# Altium schematic sheet [3] TopLevel.SchDoc: =DocumentName
size A3; ENG_APP_DATE: --/--/--; DSN_APP_DATE: --/--/--; CHK_APP_DATE: --/--/--; Organization: ORGANIZATION; Address1: R. Aprígio Veloso, 882, Universitário; Address2: Campina Grande - PB; Address3: 58429-900; DocumentNumber: 3; Revision: -; SheetNumber: 3; SheetTotal: 9; ENG_DATE: --/--/--; DSN_DATE: --/--/--; CHK_DATE: --/--/--; SCH_SCALE: 1:1
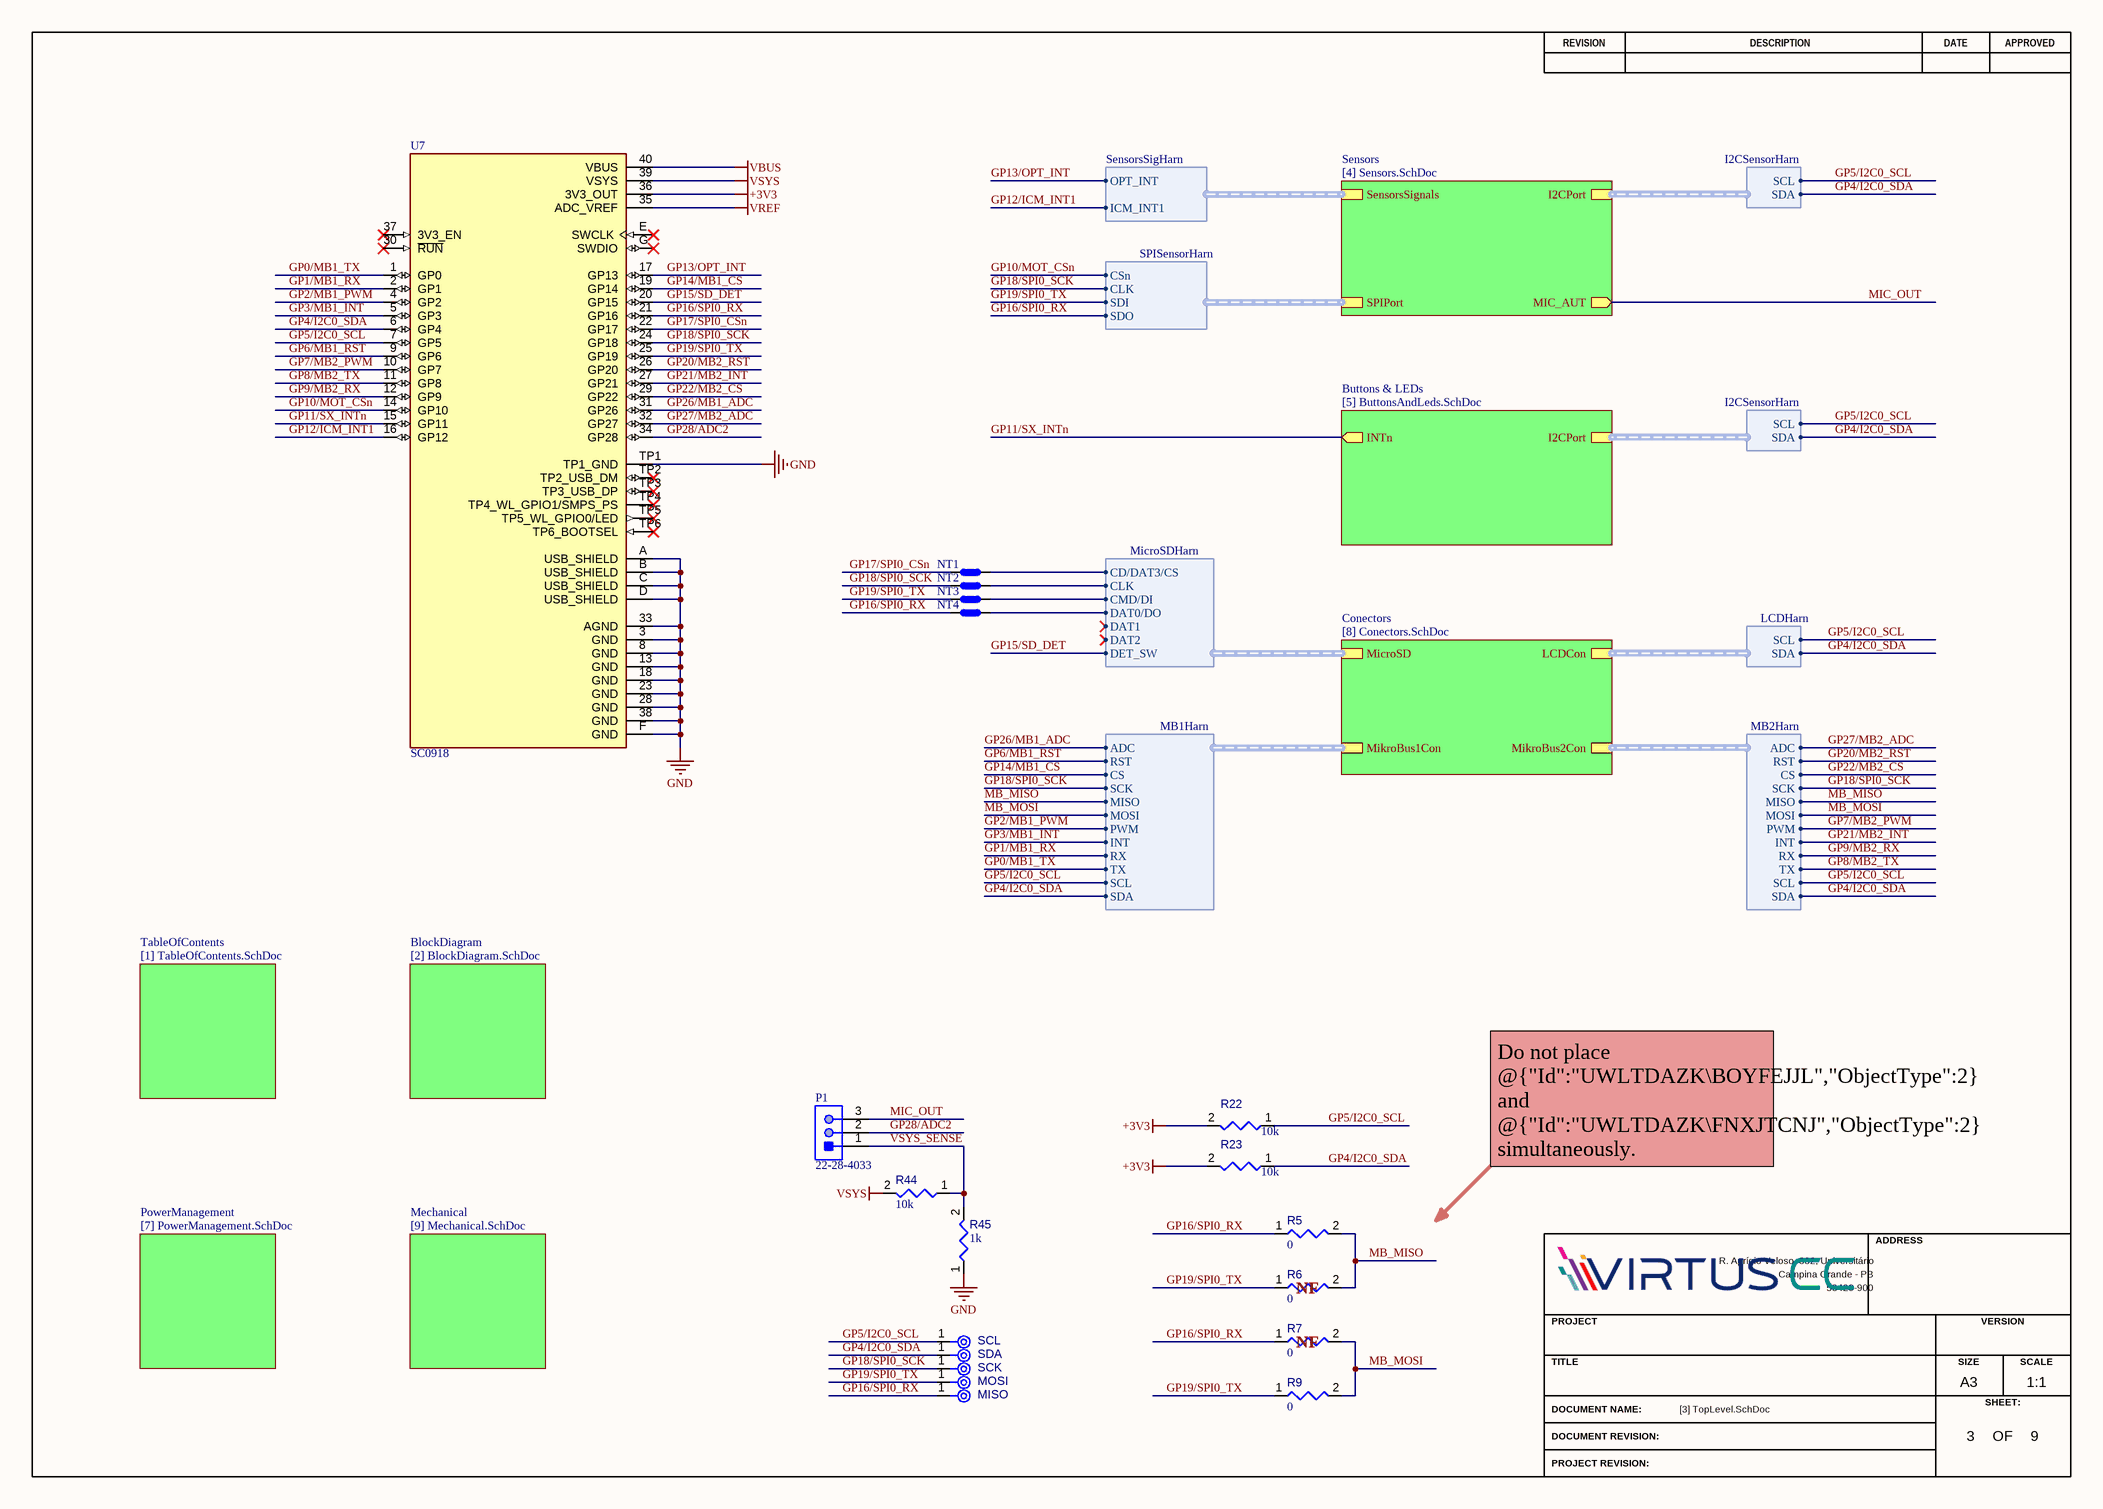
[diagram p0: [3] TopLevel.SchDoc]

## Parts
MISO  TPAD6R  [TP06R]  (value not drawn)  (no BOM)
MOSI  TPAD6R  [TP06R]  (value not drawn)  (no BOM)
NT1  Net Tie  [New footprint 1]  (value not drawn)  (net tie, no BOM)
NT2  Net Tie  [New footprint 1]  (value not drawn)  (net tie, no BOM)
NT3  Net Tie  [New footprint 1]  (value not drawn)  (net tie, no BOM)
NT4  Net Tie  [New footprint 1]  (value not drawn)  (net tie, no BOM)
P1  22-28-4033  [MOLX-22-28-4033_V]
R5  value 0  [RESC0603(1608)_L]  (hidden comment: Resistor 0R +/- 5% 0603 100 mW)
R6  value 0  [RESC0603(1608)_L]  (hidden comment: Resistor 0R +/- 5% 0603 100 mW)
R7  value 0  [RESC0603(1608)_L]  (hidden comment: Resistor 0R +/- 5% 0603 100 mW)
R9  value 0  [RESC0603(1608)_L]  (hidden comment: Resistor 0R +/- 5% 0603 100 mW)
R22  value 10k  [RESC0603(1608)_L]  (hidden comment: Resistor 10k +/-1% 0603 100 mW)
R23  value 10k  [RESC0603(1608)_L]  (hidden comment: Resistor 10k +/-1% 0603 100 mW)
R44  value 10k  [RESC0603(1608)_L]  (hidden comment: Resistor 10k +/-1% 0603 100 mW)
R45  value 1k  [RESC0603(1608)_L]  (hidden comment: Resistor 1k +/-1% 0603 100 mW)
SCK  TPAD6R  [TP06R]  (value not drawn)  (no BOM)
SCL  TPAD6R  [TP06R]  (value not drawn)  (no BOM)
SDA  TPAD6R  [TP06R]  (value not drawn)  (no BOM)
U7  SC0918  [MODULE_SC0918]

## Sub-sheets
BlockDiagram = [2] BlockDiagram.SchDoc: no entries
Buttons & LEDs = [5] ButtonsAndLeds.SchDoc: INTn (out), I2CPort (harness I2CSensorHarn)
Conectors = [8] Conectors.SchDoc: MicroSD (harness MicroSDHarn), LCDCon (harness LCDHarn), MikroBus1Con (harness MB1Harn), MikroBus2Con (harness MB2Harn)
Mechanical = [9] Mechanical.SchDoc: no entries
PowerManagement = [7] PowerManagement.SchDoc: no entries
Sensors = [4] Sensors.SchDoc: I2CPort (harness I2CSensorHarn), SPIPort (harness SPISensorHarn), SensorsSignals (harness SensorsSigHarn), MIC_AUT (out)
TableOfContents = [1] TableOfContents.SchDoc: no entries

## Harnesses
MicroSDHarn: CD/DAT3/CS, CLK, CMD/DI, DAT0/DO, DAT1, DAT2, DET_SW
LCDHarn: SCL, SDA
SensorsSigHarn: OPT_INT, ICM_INT1
SPISensorHarn: CLK, CSn, SDI, SDO
I2CSensorHarn: SCL, SDA
MB1Harn: ADC, RST, CS, SCK, MISO, MOSI, PWM, INT, RX, TX, SCL, SDA
MB2Harn: ADC, RST, CS, SCK, MISO, MOSI, PWM, INT, RX, TX, SCL, SDA

## Nets
+3V3: R22.2 R23.2 U7.36(3V3_OUT)
GND: R45.1 U7.3(GND) U7.8(GND) U7.13(GND) U7.18(GND) U7.23(GND) U7.28(GND) U7.33(AGND) U7.38(GND) U7.A(USB_SHIELD) U7.B(USB_SHIELD) U7.C(USB_SHIELD) U7.D(USB_SHIELD) U7.F(GND) U7.TP1(TP1_GND)
VBUS: U7.40(VBUS)
VREF: U7.35(ADC_VREF)
VSYS: R44.2 U7.39(VSYS)
GP0/MB1_TX: U7.1(GP0) ; sheet Conectors/MikroBus1Con.TX
GP1/MB1_RX: U7.2(GP1) ; sheet Conectors/MikroBus1Con.RX
GP2/MB1_PWM: U7.4(GP2) ; sheet Conectors/MikroBus1Con.PWM
GP3/MB1_INT: U7.5(GP3) ; sheet Conectors/MikroBus1Con.INT
GP4/I2C0_SDA: R23.1 SDA.1(TP) U7.6(GP4) ; sheet Conectors/LCDCon.SDA, sheet Sensors/I2CPort.SDA, sheet Buttons & LEDs/I2CPort.SDA, sheet Conectors/MikroBus1Con.SDA, sheet Conectors/MikroBus2Con.SDA
GP5/I2C0_SCL: R22.1 SCL.1(TP) U7.7(GP5) ; sheet Conectors/LCDCon.SCL, sheet Sensors/I2CPort.SCL, sheet Buttons & LEDs/I2CPort.SCL, sheet Conectors/MikroBus1Con.SCL, sheet Conectors/MikroBus2Con.SCL
GP6/MB1_RST: U7.9(GP6) ; sheet Conectors/MikroBus1Con.RST
GP7/MB2_PWM: U7.10(GP7) ; sheet Conectors/MikroBus2Con.PWM
GP8/MB2_TX: U7.11(GP8) ; sheet Conectors/MikroBus2Con.TX
GP9/MB2_RX: U7.12(GP9) ; sheet Conectors/MikroBus2Con.RX
GP10/MOT_CSn: U7.14(GP10) ; sheet Sensors/SPIPort.CSn
GP11/SX_INTn: U7.15(GP11) ; sheet Buttons & LEDs/INTn
GP12/ICM_INT1: U7.16(GP12) ; sheet Sensors/SensorsSignals.ICM_INT1
GP13/OPT_INT: U7.17(GP13) ; sheet Sensors/SensorsSignals.OPT_INT
GP14/MB1_CS: U7.19(GP14) ; sheet Conectors/MikroBus1Con.CS
GP15/SD_DET: U7.20(GP15) ; sheet Conectors/MicroSD.DET_SW
GP16/SPI0_RX: MISO.1(TP) NT4.1 R5.1 R7.1 U7.21(GP16) ; sheet Sensors/SPIPort.SDO
GP17/SPI0_CSn: NT1.1 U7.22(GP17)
GP18/SPI0_SCK: NT2.1 SCK.1(TP) U7.24(GP18) ; sheet Sensors/SPIPort.CLK, sheet Conectors/MikroBus1Con.SCK, sheet Conectors/MikroBus2Con.SCK
GP19/SPI0_TX: MOSI.1(TP) NT3.1 R6.1 R9.1 U7.25(GP19) ; sheet Sensors/SPIPort.SDI
GP20/MB2_RST: U7.26(GP20) ; sheet Conectors/MikroBus2Con.RST
GP21/MB2_INT: U7.27(GP21) ; sheet Conectors/MikroBus2Con.INT
GP22/MB2_CS: U7.29(GP22) ; sheet Conectors/MikroBus2Con.CS
GP26/MB1_ADC: U7.31(GP26) ; sheet Conectors/MikroBus1Con.ADC
GP27/MB2_ADC: U7.32(GP27) ; sheet Conectors/MikroBus2Con.ADC
GP28/ADC2: P1.2 U7.34(GP28)
MB_MISO: R5.2 R6.2 ; sheet Conectors/MikroBus1Con.MISO, sheet Conectors/MikroBus2Con.MISO
MB_MOSI: R7.2 R9.2 ; sheet Conectors/MikroBus1Con.MOSI, sheet Conectors/MikroBus2Con.MOSI
MIC_OUT: P1.3 ; sheet Sensors/MIC_AUT
VSYS_SENSE: P1.1 R44.1 R45.2
NetNT1_2: NT1.2 ; sheet Conectors/MicroSD.CD/DAT3/CS
NetNT2_2: NT2.2 ; sheet Conectors/MicroSD.CLK
NetNT3_2: NT3.2 ; sheet Conectors/MicroSD.CMD/DI
NetNT4_2: NT4.2 ; sheet Conectors/MicroSD.DAT0/DO

Not connected (* = marked no-connect by the designer): U7 30(~{RUN})* 37(3V3_EN)* E(SWCLK)* G(SWDIO)* TP2(TP2_USB_DM)* TP3(TP3_USB_DP)* TP4(TP4_WL_GPIO1/SMPS_PS)* TP5(TP5_WL_GPIO0/LED)* TP6(TP6_BOOTSEL)*

## Notes on the sheet
- Do not place @{"Id":"UWLTDAZK\BOYFEJJL","ObjectType":2} and @{"Id":"UWLTDAZK\FNXJTCNJ","ObjectType":2} simultaneously.
  Do not place @{"Id":"UWLTDAZK\CHTEIYBT","ObjectType":2} and @{"Id":"IOCENJZE\NTQAKYMT","ObjectType":2} simultaneously.
- (near R6) NF
- (near R7) NF
- REVISION
- DESCRIPTION
- DATE
- APPROVED
- ADDRESS
- PROJECT
- VERSION
- TITLE
- A3
- SIZE
- SCALE
- DOCUMENT NAME:
- DOCUMENT REVISION:
- OF
- SHEET:
- PROJECT REVISION:

## Library data of the parts
MISO MOSI SCK SCL SDA = CMP-00028-00002-2: 0.6mm round; Pins: 1
NT1-NT4 = CMP-001-0003-6: Net Tie 0.3mm
P1 = CMP-002-00076-1: KK 254 Breakaway Header Vertical 3 Circuits 0.38um Gold Selective Plating Mating Pin 6.09mm; Pitch: 2.54mm; Number of Positions: 3; Contact Resistance: 20mR; Max Voltage Rating (AC): 250V; Current Rating: 4A; Gender: Male; Glow Wire Compliant: Non-compliant; RoHS Compliant: Yes; Contact Plating: Gold; Housing Color: Black; Housing Material: Nylon; Contact Mating Length: 0.24inch; Depth: 2.49mm; Number of Circuits: 3; Reach SVHC Compliant: Unknown; Packaging: Bulk; Max Voltage Rating (DC): 250V; Number of Rows: 1; Color: Black; Package Quantity: 1; Orientation: Straight; Number of Contacts: 3; Max Operating Temperature: 75°C; Mounting Technology: Through Hole; Min Operating Temperature: 0°C; Termination: Solder; Radiation Hardening: No; Series: KK® 42375; Contact Material: Brass,Bronze; Flammability Rating: UL94 V-0; Lead Free: Lead Free; Contact Type: Male Pin; Voltage Rating: 250V; Voltage Rating (DC): 250V
R5-R7 R9 = CMP-009-00006-6: Chip Resistor, 0 Ohm, 0.1 W, -55 to 155 degC, 0603 (1608 Metric); Power: 100mW; Voltage Rating: 50V; Tolerance: 5%; Mounting Technology: SM; RoHS Compliant: True; Max Operating Temperature: 155°C; Min Operating Temperature: -55°C; Case/Package: 0603; Pins: 2
R22 R23 R44 = CMP-009-00017-7: Chip Resistor, 10 KOhm, +/- 1%, 01 W, -55 to 155 degC, 0603 (1608 Metric); Voltage Rating: 50V; Power: 100mW; RoHS Compliant: True; Min Operating Temperature: -55°C; Pins: 2; Case/Package: 0603; Mounting Technology: SM; Max Operating Temperature: 155°C; Tolerance: 1%
R45 = CMP-009-00014-6: Chip Resistor, 1 KOhm, +/-1%, 0.1 W, -55 to 155 degC, 0603 (1608 Metric); Power: 100mW; Tolerance: 1%; Voltage Rating: 50V; Mounting Technology: SM; Case/Package: 0603; Min Operating Temperature: -55°C; RoHS Compliant: True; Max Operating Temperature: 155°C; Pins: 2
U7 = CMP-006-000001-6: Raspberry Pi Pico W RP2040; Pin Count: 53; MP: SC0918; Availability: In Stock; Source: SC0918.SchLib; Purchase-URL: https://pricing.snapeda.com/search/part/SC0918/?ref=eda; Price: None; MF: Raspberry Pi; Component Type: Standard; Design Item ID: SC0918; SnapEDA_Link: https://www.snapeda.com/parts/SC0918/Raspberry+Pi/view-part/?ref=snap; Check_prices: https://www.snapeda.com/parts/SC0918/Raspberry+Pi/view-part/?ref=eda; Value: *; Package: None